# EAGLE design transmitter_fm (EAGLE 7.1.0)
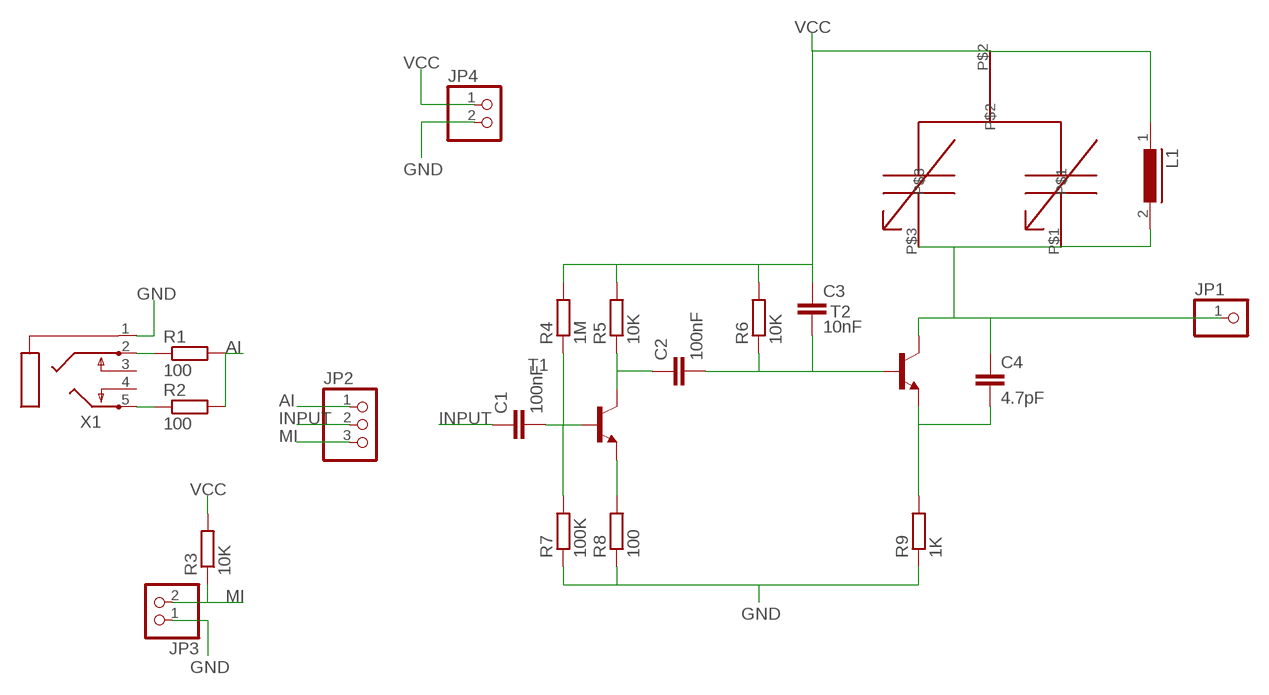
[diagram p0: schematic, sheet 1]

## Parts
C1  100nF  C-EU050-035X075  [C050-035X075]
C2  100nF  C-EU050-035X075  [C050-035X075]
C3  10nF  C-EU050-035X075  [C050-035X075]
C4  4.7pF  C-EU025-025X050  [C025-025X050]
JP1  PINHD-1X1  [1X01]
JP2  PINHD-1X3  [1X03]
JP3  PINHD-1X2  [1X02]
JP4  PINHD-1X2  [1X02]
L1  DS10  [DS10]
R1  100  R-EU_0207/7  [0207/7]
R2  100  R-EU_0207/7  [0207/7]
R3  10K  R-EU_0207/7  [0207/7]
R4  1M  R-EU_0207/7  [0207/7]
R5  10K  R-EU_0207/7  [0207/7]
R6  10K  R-EU_0207/7  [0207/7]
R7  100K  R-EU_0207/7  [0207/7]
R8  100  R-EU_0207/7  [0207/7]
R9  1K  R-EU_0207/7  [0207/7]
T1  2N3904  [TO92]
T2  2N3904  [TO92]
U$1  VARCO_KEMATIAN_DEV  [VARCO_KEMATIAN]
X1  PG203J  [PG203J]

## Nets
AI: JP2.1 R1.2 R2.2
GND: JP3.1 JP4.2 R7.1 R8.1 R9.1 X1.1
INPUT: C1.1 JP2.2
MI: JP2.3 JP3.2 R3.1
N$1: C1.2 R4.1 R7.2 T1.2(B)
N$2: R8.2 T1.3(E)
N$3: C2.1 R5.1 T1.1(C)
N$4: C2.2 C3.2 R6.1 T2.2(B)
N$5: C4.2 R9.2 T2.3(E)
N$6: R2.1 X1.5
N$7: C4.1 JP1.1 L1.2 T2.1(C) U$1.P$1 U$1.P$3
N$8: R1.1 X1.2
VCC: C3.1 JP4.1 L1.1 R3.2 R4.2 R5.2 R6.2 U$1.P$2
Unconnected: X1.3 X1.4

## Library data of the parts
C1-C4 = rcl:C-EU: CAPACITOR, European symbol
JP1 = pinhead:PINHD-1X1: PIN HEADER
JP2 = pinhead:PINHD-1X3: PIN HEADER
JP3 JP4 = pinhead:PINHD-1X2: PIN HEADER
L1 = inductors:DS10: INDUCTOR
R1-R9 = rcl:R-EU_: RESISTOR, European symbol
T1 T2 = transistor:2N3904: NPN TRANSISTOR
U$1 = diy_bojar:VARCO_KEMATIAN_DEV
X1 = con-hirschmann:PG203J: MIC/HEADPHONE JACK KS-S stereo microphone/headphone jack PG203JN (Schukat); OC_FARNELL: unknown; OC_NEWARK: unknown

## Board
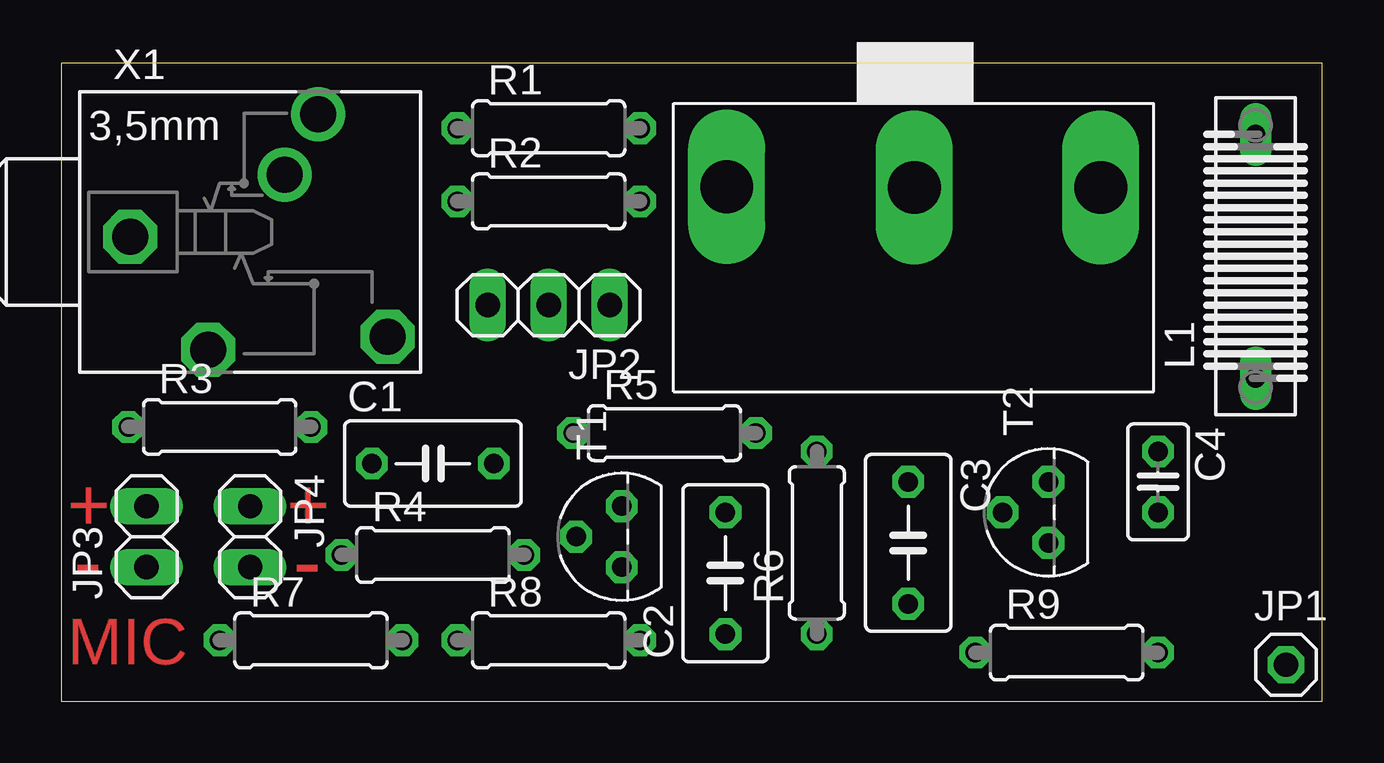
[diagram p1: board, top side]
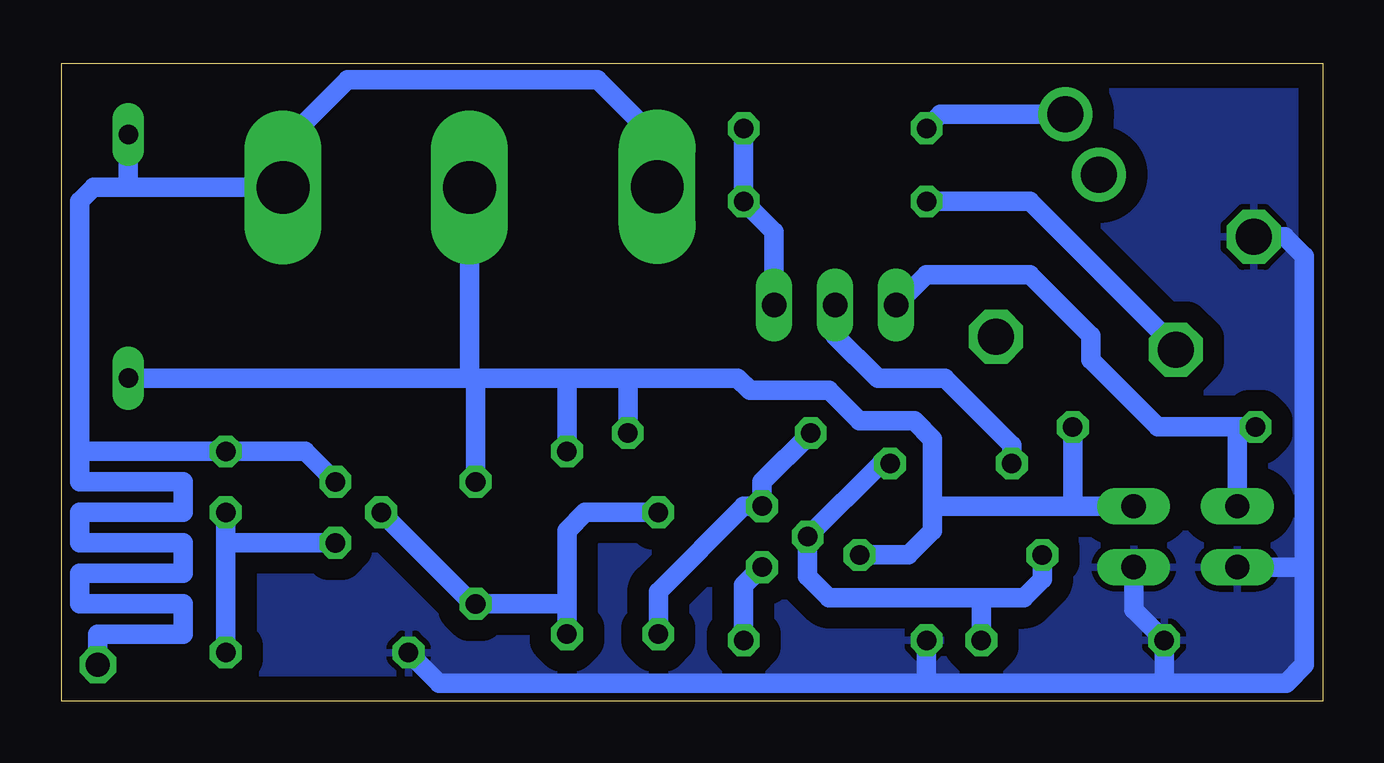
[diagram p2: board, bottom side, seen from below]

Size 52.56 x 26.59 mm. Coordinates in mm from the lower left corner, seen from the top.
Outline: 0,0 52.56,0 52.56,26.59 0,26.59 0,0
Copper layers (1*16): Top 0.035mm / dielectric 1.5mm / Bottom 0.035mm
Design rules "default *": minimum track width 10mil, minimum drill 24mil, track to track 35mil, track to pad 35mil, pad to pad 8mil, via to via 8mil, smd to smd 8mil, copper to edge 40mil, drill to drill 8mil, minimum pad ring 10mil, minimum via ring 8mil, stop-mask expansion 4mil, vias tented up to drill 0mil, thermal gap 10mil

### Footprints (pad centres in the part's own frame; a part is rotated, then mirrored left to right if it is on the bottom)
C050-035X075 = drill 0.813 octagon: 1 -2.54,0; 2 2.54,0
C025-025X050 = drill 0.813 octagon: 1 -1.27,0; 2 1.27,0
1X01 = drill 1.016 octagon: 1 0,0
1X03 = drill 1.016 long: 1 -2.54,0; 2 0,0; 3 2.54,0
1X02 = drill 1.016 long: 1 -1.27,0; 2 1.27,0
DS10 = drill 0.813 long: 1 -5.08,0; 2 5.08,0
0207/7 = drill 0.813 octagon: 1 -3.81,0; 2 3.81,0
TO92 = drill 0.813 octagon: 1 1.27,0; 2 0,1.905; 3 -1.27,0
VARCO_KEMATIAN = drill 2.2 long: P$1 -7.823,5.944; P$2 0,5.918; P$3 7.772,5.918
PG203J = drill 1.499 octagon: 1 -5.004,-0.203; 4 5.74,-4.369; 5 -1.753,-4.902 | drill 1.499: 2 2.845,4.902; 3 1.448,2.388

### Placement (x,y rotation side)
C1  15.49,9.91 0 top
C2  27.69,5.33 90 top
C3  35.31,6.6 270 top
C4  45.72,9.14 270 top
JP1  51.05,1.52 0 top
JP2  20.32,16.51 180 top
JP3  3.56,6.86 90 top
JP4  7.87,6.86 270 top
L1  49.78,18.54 90 top
R1  20.32,23.88 0 top
R2  20.32,20.83 0 top
R3  6.6,11.43 0 top
R4  15.49,6.1 0 top
R5  25.15,11.18 0 top
R6  31.5,6.6 90 top
R7  10.41,2.54 0 top
R8  20.32,2.54 0 top
R9  41.91,2.03 0 top
T1  23.37,6.86 90 top
T2  41.15,7.87 90 top
U$1  35.56,15.49 0 top
X1  7.87,19.56 0 top

### Tracks (layer width: path | path; a pad name or v marks a point on that pad's centre or on a via)
AI
  Bottom 0.813: R1.2 R2.2 22.86,19.56 JP2.1
GND
  Bottom 0.813: 16.51,0.76 36.83,0.76 R9.1 | 16.51,0.76 6.86,0.76 | 6.86,0.76 1.52,0.76 0.76,1.52 0.76,5.59 | R8.1 16.51,0.76 | 6.86,0.76 6.6,1.02 R7.1 7.87,3.81 JP4.2 | X1.1 1.58,19.36 0.76,18.54 0.76,5.59 | JP3.1 0.76,5.59
  pour Bottom: 0,26.67 52.58,26.67 52.58,0 0,0
INPUT
  Bottom 0.813: JP2.2 20.32,15.24 18.54,13.46 15.75,13.46 12.95,10.67 C1.1
MI
  Bottom 0.813: R3.1 3.56,11.43 | 3.56,11.43 6.86,11.43 9.65,14.22 9.65,15.24 12.19,17.78 16.51,17.78 JP2.3 | JP3.2 3.56,11.43
N$1
  Bottom 0.813: R7.2 14.22,4.32 | 14.22,4.32 20.57,4.32 21.46,5.21 T1.2 18.41,9.91 C1.2 | 14.22,4.32 12.45,4.32 11.68,5.08 R4.1
N$2
  Bottom 0.813: R8.2 24.13,4.83 T1.3
N$3
  Bottom 0.813: C2.1 27.69,4.57 24.13,8.13 T1.1 23.37,9.14 R5.1
N$4
  Bottom 0.813: 31.5,4.06 C3.2 35.43,4.06 T2.2 | R6.1 31.5,4.06 | 31.5,4.06 31.5,7.11 30.73,7.87 C2.2
N$5
  Bottom 0.813: C4.2 45.72,6.35 | 45.72,6.35 R9.2 | T2.3 45.47,6.6 45.72,6.35
N$6
  Bottom 0.813: R2.1 12.19,20.83 6.12,14.76 X1.5
N$7
  Bottom 0.813: 51.82,10.41 C4.1 42.42,10.41 T2.1 | 51.82,10.41 51.82,20.83 51.23,21.41 49.53,21.41 | 49.53,21.41 U$1.P$3 43.33,23.22 40.64,25.91 30.23,25.91 27.74,23.42 U$1.P$1 | L1.2 49.78,21.67 49.53,21.41 | 51.82,10.41 51.82,9.14 47.5,9.14 47.5,7.87 51.82,7.87 51.82,6.6 47.5,6.6 47.5,5.33 51.82,5.33 51.82,4.06 47.5,4.06 47.5,2.79 51.05,2.79 JP1.1
N$8
  Bottom 0.813: X1.2 15.93,24.46 R1.1
VCC
  Bottom 0.813: R5.2 28.96,13.46 | 28.96,13.46 31.75,13.46 | 31.75,13.46 35.56,13.46 | 35.56,13.46 35.81,13.46 | 35.81,13.46 L1.1 | C3.1 35.31,13.21 35.56,13.46 | R6.2 31.5,13.21 31.75,13.46 | 28.96,13.46 24.38,13.46 23.88,12.95 20.57,12.95 19.3,11.68 17.02,11.68 16.26,10.92 16.26,8.13 | 16.26,8.13 16.26,7.11 17.27,6.1 R4.2 | JP4.1 10.41,8.13 | 10.41,8.13 16.26,8.13 | R3.2 10.41,8.13 | U$1.P$2 35.56,13.72 35.81,13.46

### Text on the board
Top: + | + | - | - | MIC